# EasyEDA Pro project ProPrj_主稳压电路_2025-12-27.epro, schematic 外设电路_1

## Sheets
1 过流保护+过压保护+过热保护: Board Name: 外设电路; Create Date: 2025-11-29; Page Name: 过流保护+过压保护+电网电压预处理（含防雷保护）; Project Name: 稳压电路; Schematic Name: 外设电路; Update Date: 2025-12-01; BladeWidth: 10; Company: 嘉立创EDA; Page Size: A4; RegionStart: 1; ShowBorder: 1; TitleBlock: 1; TitleBlockPosition: 3; Version: V1.0; XRegionCount: 6; YRegionCount: 4
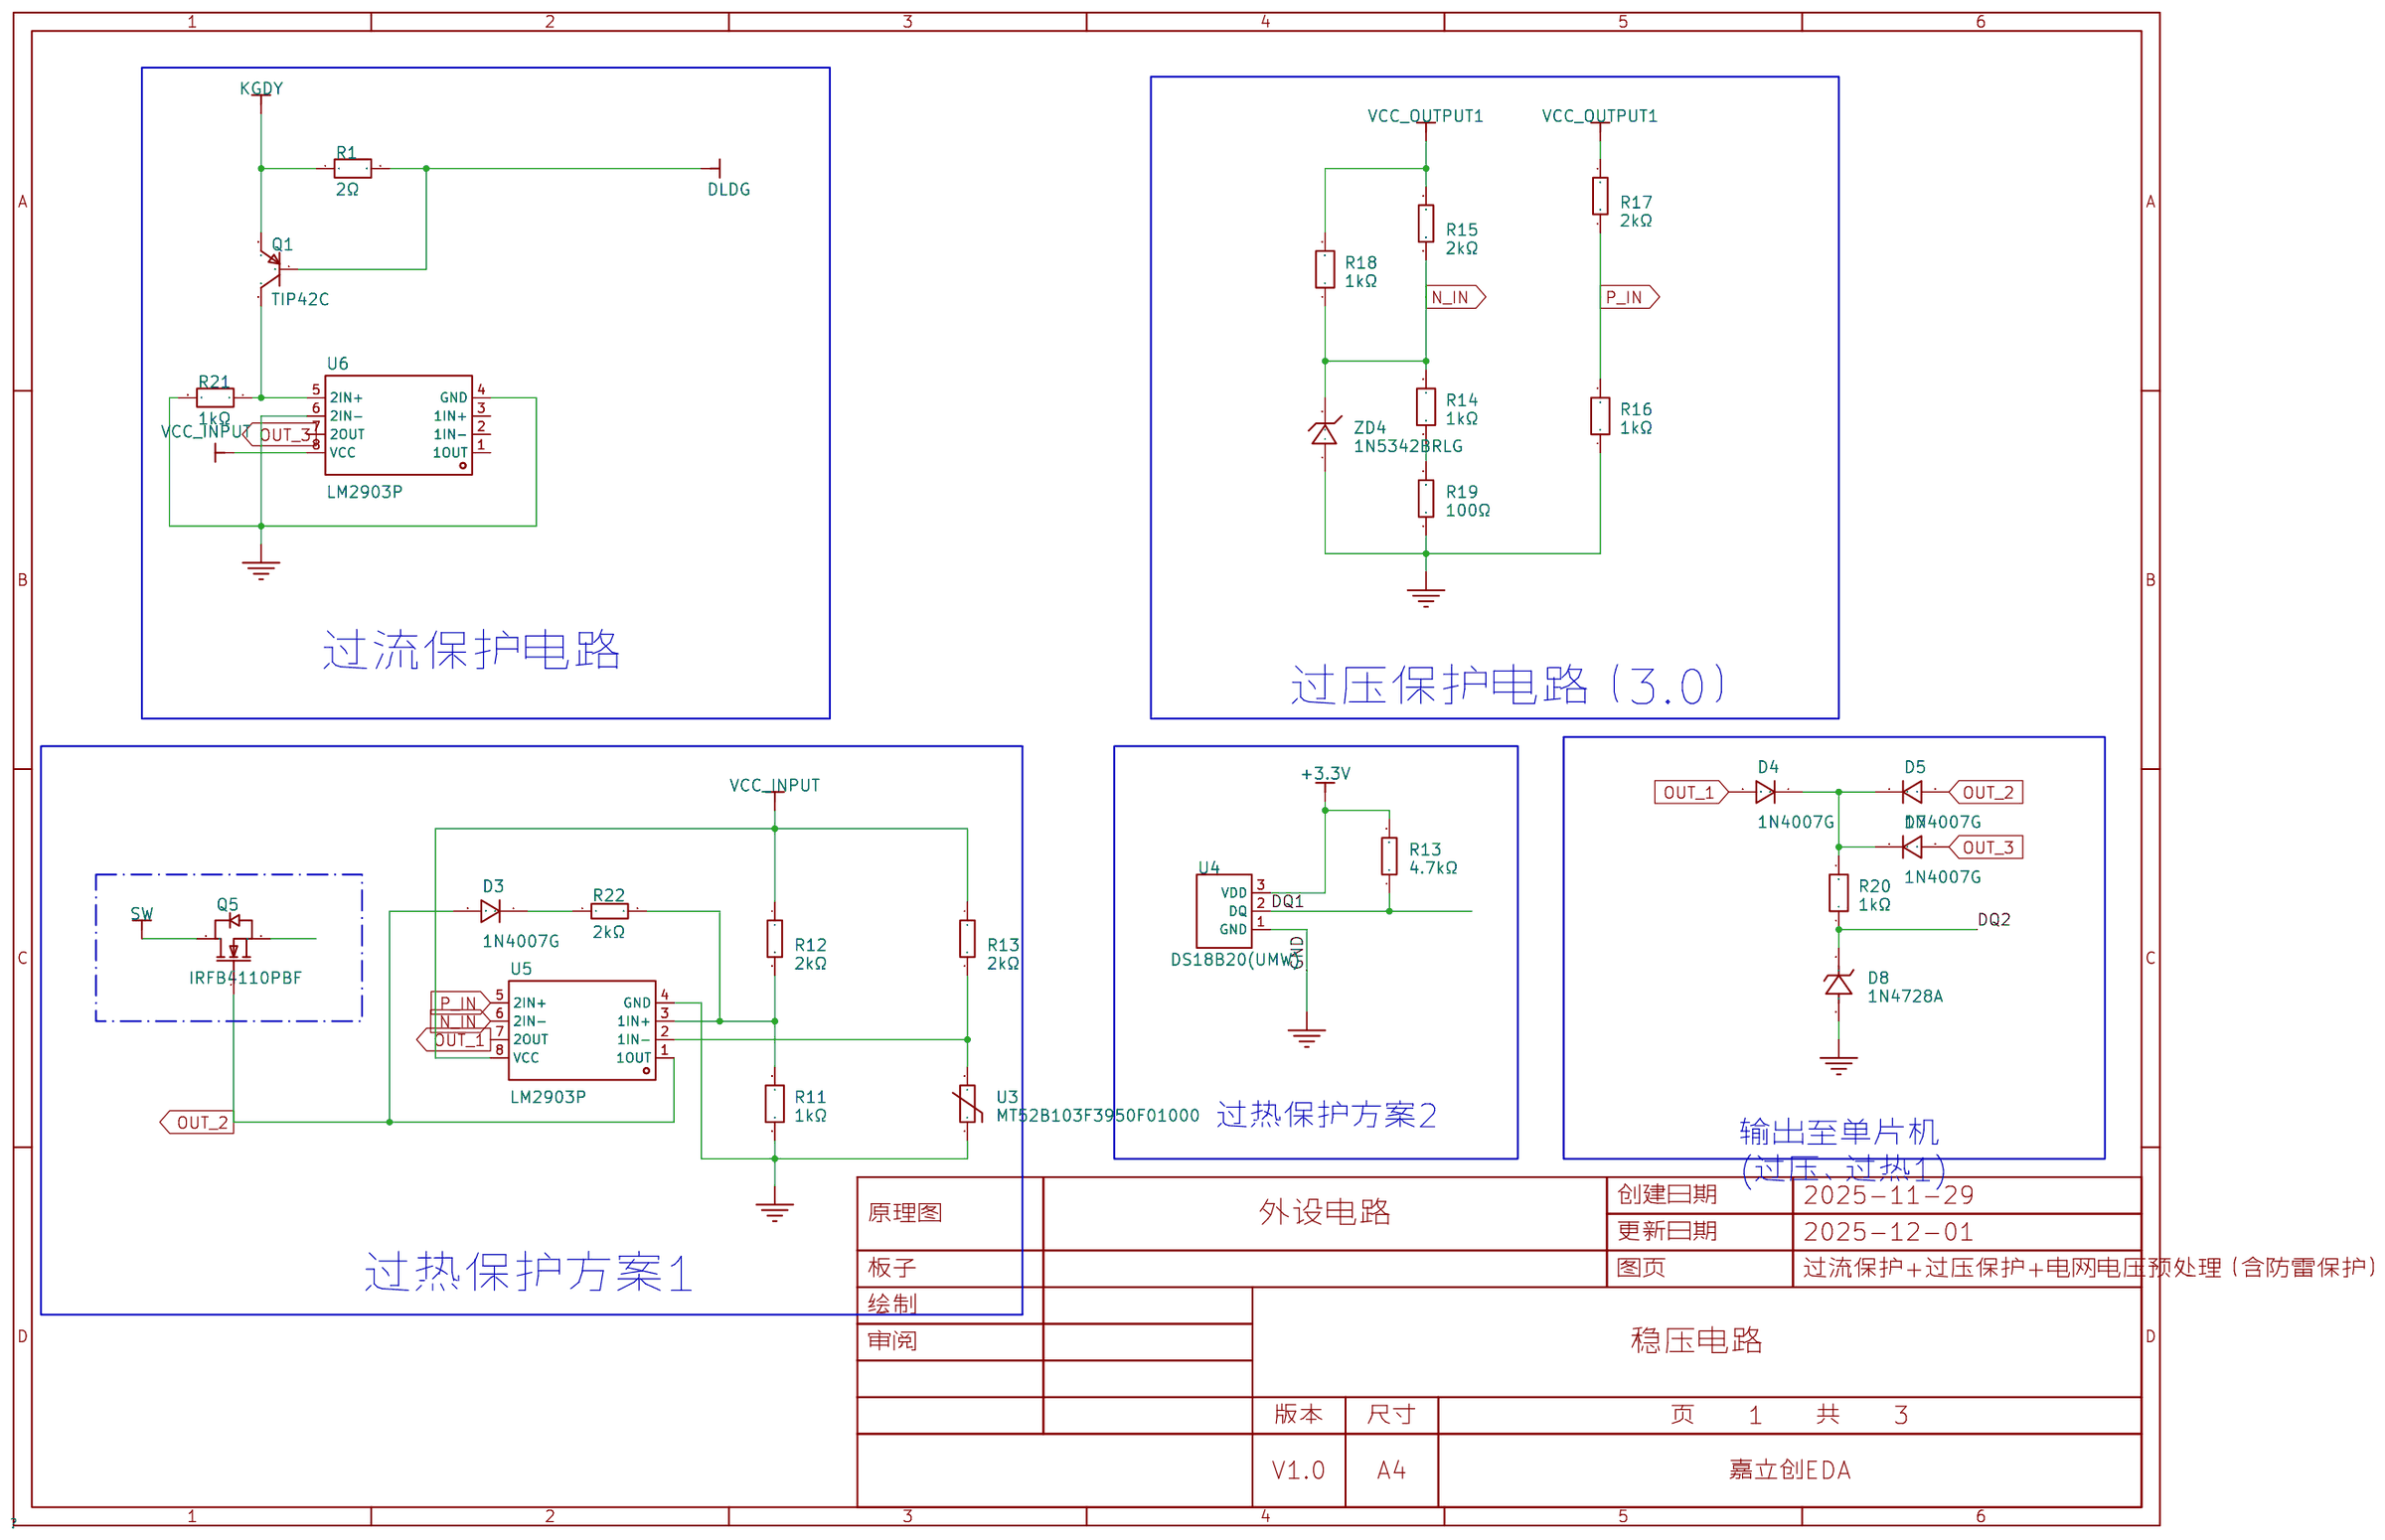
[diagram p3: 过流保护+过压保护+过热保护]
2 电压预处理: Create Date: 2025-11-30; Page Name: 过热保护
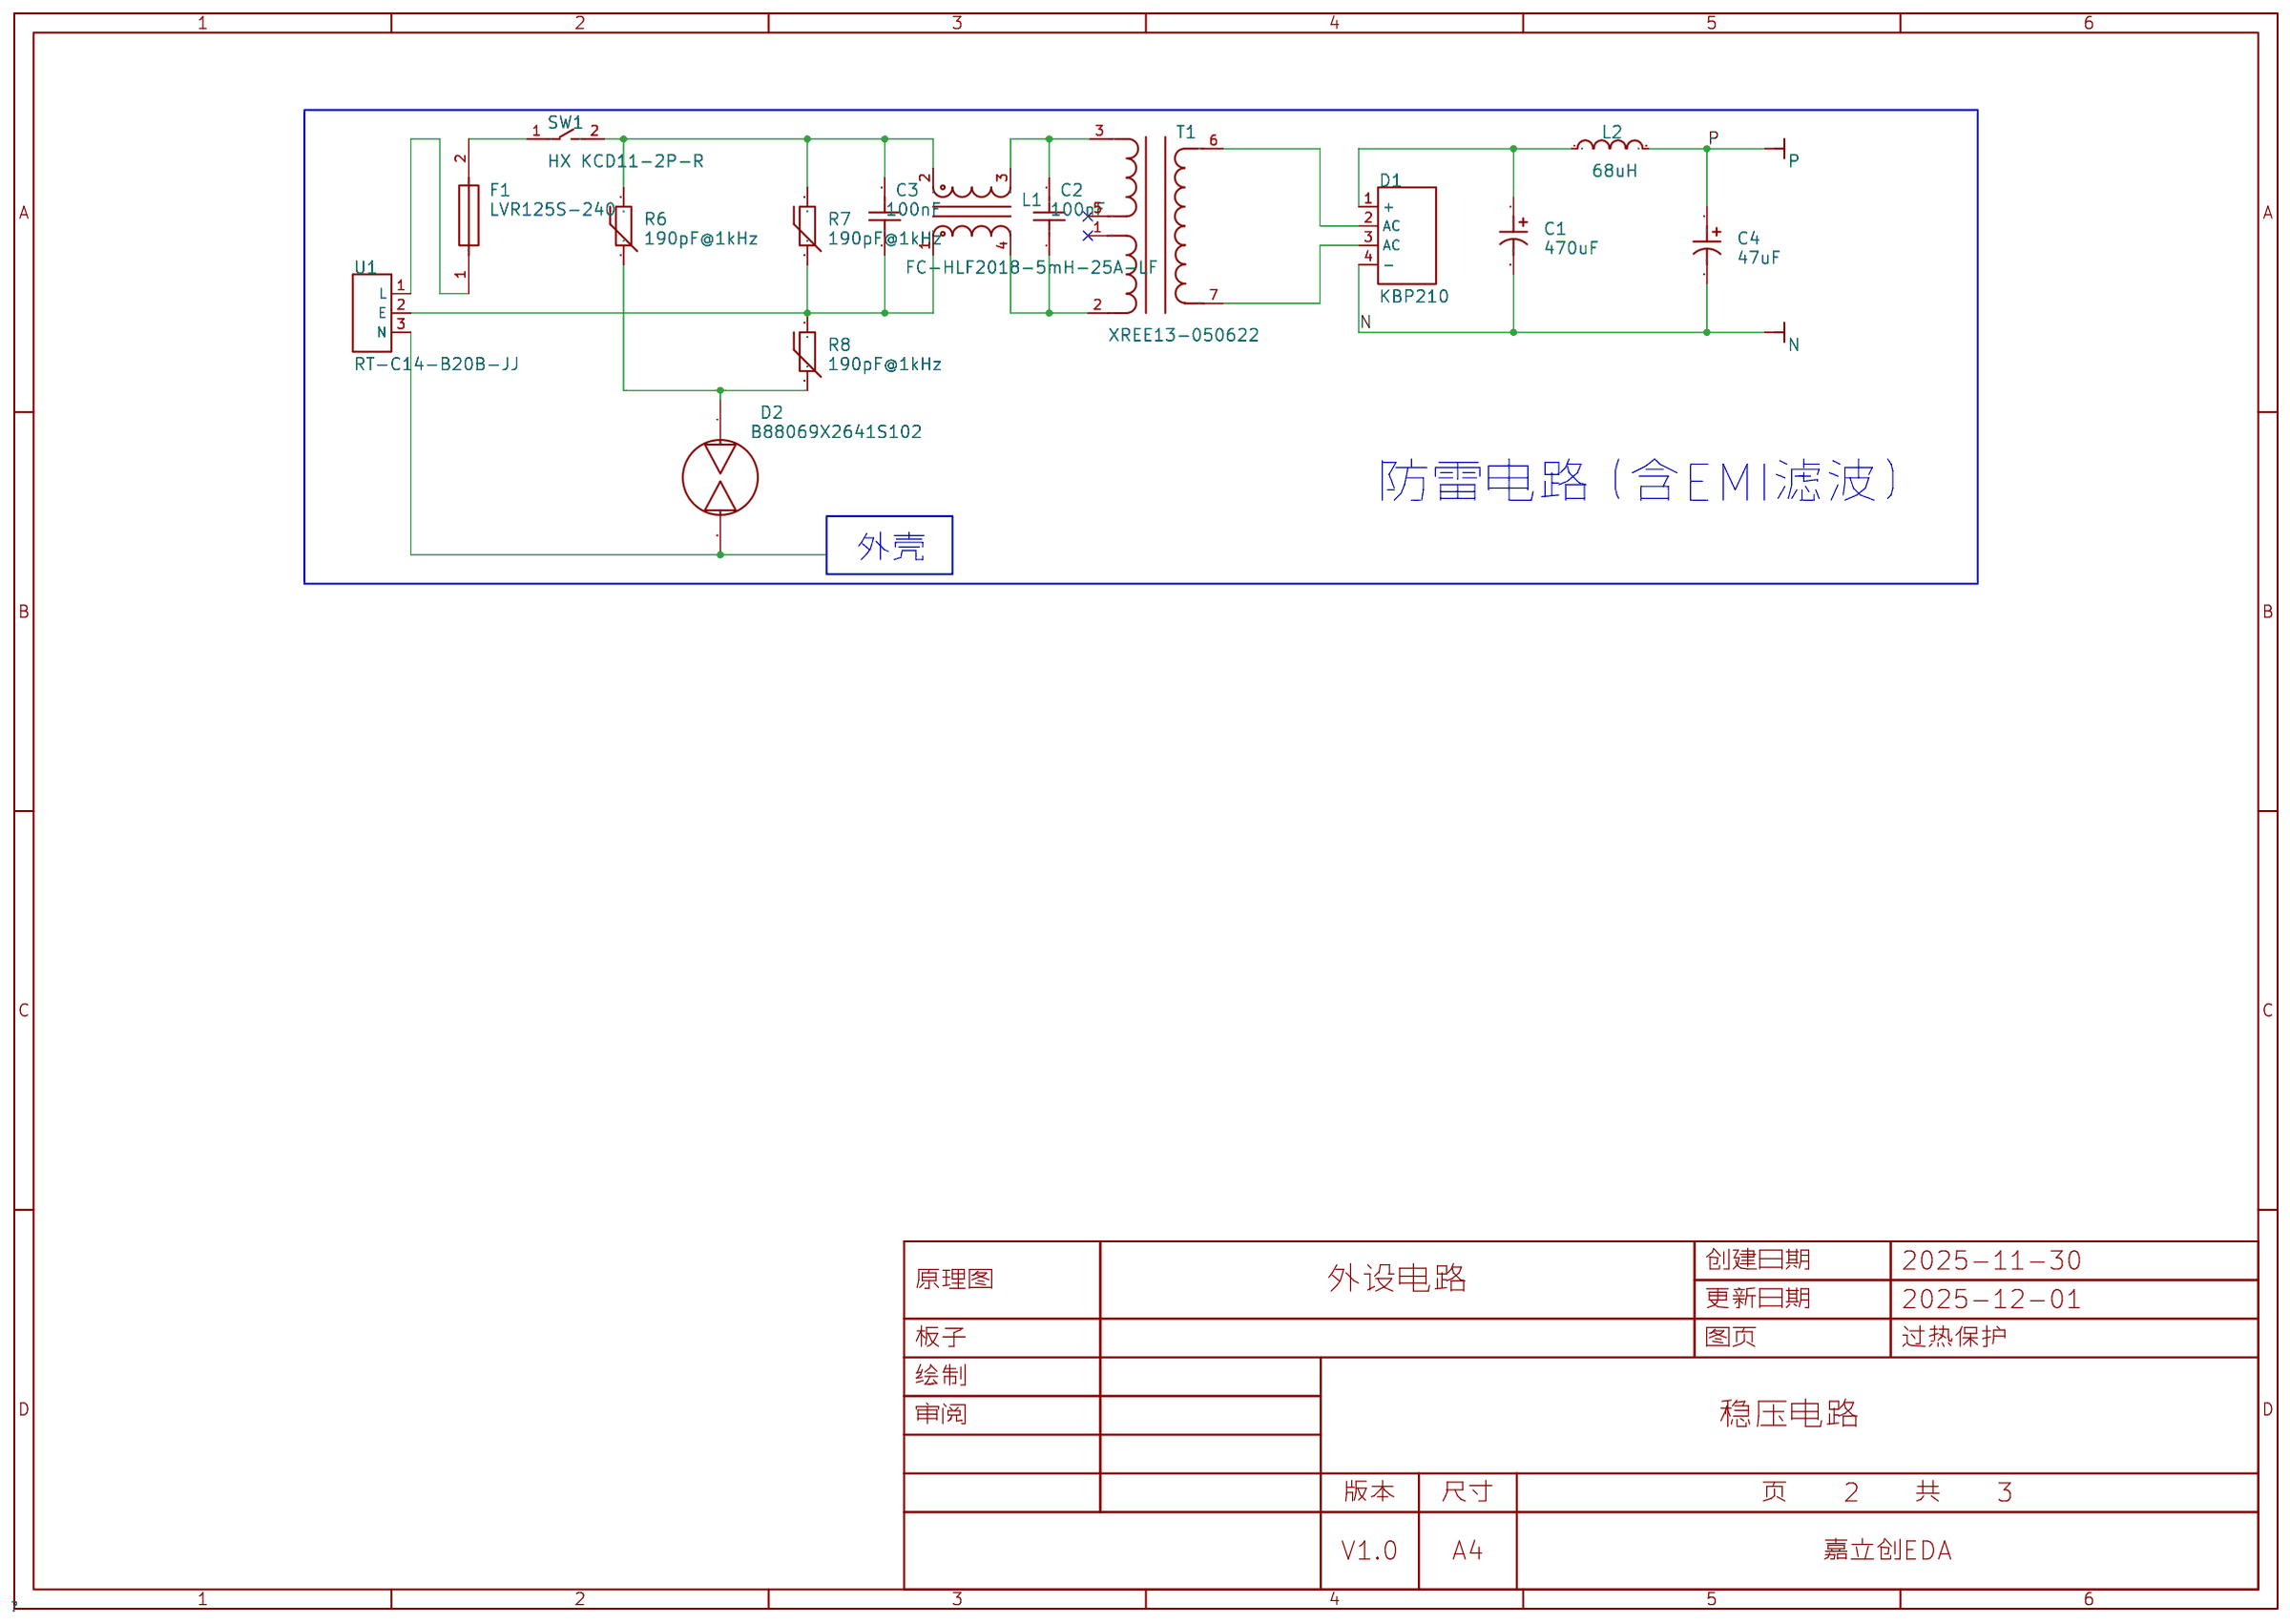
[diagram p4: 电压预处理]

## Parts
sheet 电压预处理
C1  470uF  [CAP-TH_BD10.0-P5.00-D0.6-FD]
C2  100nF  [CAP-TH_L13.0-W6.0-P10.0-D0.6]
C3  100nF  [CAP-TH_L13.0-W6.0-P10.0-D0.6]
C4  47uF  [CAP-TH_BD6.3-P2.50-D0.6-FD]
D1  KBP210  [KBP_4P-L14.5-W3.5-P3.81-L]
D2  B88069X2641S102  [DIO-DT-TH_L8.0-W6.0]
F1  LVR125S-240  [FUSE-TH_L21.2-W5.3]
L1  FC-HLF2018-5mH-25A-LF  [IND-TH_4P-L22.5-W14.5-P13.00-D1.2-LS10.80]
L2  68uH  [IND-TH_BD9.5-P5.00-D0.7]
R6  190pF@1kHz  [RES-TH_L12.5-W6.7-P7.50-D1.2]
R7  190pF@1kHz  [RES-TH_L12.5-W6.7-P7.50-D1.2]
R8  190pF@1kHz  [RES-TH_L12.5-W6.7-P7.50-D1.2]
SW1  HX KCD11-2P-R  [SW-TH_2P-L15.0-W10.5-P5.00_KCD11-2P-R]
T1  XREE13-050622  [XFMR-TH_XREE13-050622]
U1  RT-C14-B20B-JJ  [AC-IN-TH_LEGION_RT-C14-B20B-JJ]
sheet 过流保护+过压保护+过热保护
D3  1N4007G  [DO-41_BD2.4-L4.7-P8.70-D0.9-RD]
D4  1N4007G  [DO-41_BD2.4-L4.7-P8.70-D0.9-RD]
D5  1N4007G  [DO-41_BD2.4-L4.7-P8.70-D0.9-RD]
D7  1N4007G  [DO-41_BD2.4-L4.7-P8.70-D0.9-RD]
D8  1N4728A  [DO-41_BD2.4-L4.7-P8.70-D0.9-RD]
Q1  TIP42C  [ITO-220AB-3_L10.2-W4.5-P2.60-L_TIP42C]
Q5  IRFB4110PBF  [TO-220-3_L10.0-W4.5-P2.54-L]
R1  2Ω  [RES-TH_BD5.0-L15.5-P19.50-D0.8]
R11  1kΩ  [RES-TH_BD2.7-L6.2-P10.20-D0.4]
R12  2kΩ  [RES-TH_BD2.3-L6.5-P10.50-D0.5]
R13  4.7kΩ  [RES-TH_BD2.3-L6.5-P10.50-D0.5]
R13#2  2kΩ  [RES-TH_BD2.3-L6.5-P10.50-D0.5]
R14  1kΩ  [RES-TH_BD2.7-L6.2-P10.20-D0.4]
R15  2kΩ  [RES-TH_BD2.3-L6.5-P10.50-D0.5]
R16  1kΩ  [RES-TH_BD2.7-L6.2-P10.20-D0.4]
R17  2kΩ  [RES-TH_BD2.3-L6.5-P10.50-D0.5]
R18  1kΩ  [RES-TH_BD2.7-L6.2-P10.20-D0.4]
R19  100Ω  [RES-TH_BD2.3-L6.5-P10.50-D0.5]
R20  1kΩ  [RES-TH_BD2.7-L6.2-P10.20-D0.4]
R21  1kΩ  [RES-TH_BD2.7-L6.2-P10.20-D0.4]
R22  2kΩ  [RES-TH_BD2.3-L6.5-P10.50-D0.5]
U3  MT52B103F3950F01000  [RES-TH_BD2.0-P1.80-D0.3]
U4  DS18B20(UMW)  [TO-92-3_L4.9-W3.7-P1.27-L]
U5  LM2903P  [DIP-8_L9.8-W6.6-P2.54-LS7.6-BL]
U6  LM2903P  [DIP-8_L9.8-W6.6-P2.54-LS7.6-BL]
ZD4  1N5342BRLG  [DO-41_BD2.8-L4.2-P8.00-D0.7-FD]

## Library data of the parts
C1 = ERA50V470M10X20: 容值:470uF;精度:±20%;额定电压:50V;; LCSC Part Name: 470uF ±20% 50V; Supplier Part: C49256816; Manufacturer: JIERR(捷而瑞); Supplier Footprint: 插件,D10xL20mm; JLCPCB Part Class: 扩展库; Datasheet: https://item.szlcsc.com/datasheet/ERA50V470M10X20/51692216.html; Supplier: LCSC; Tolerance: ±20%; Voltage Rating: 50V; Pin Spacing: 5mm; Diameter: 10mm; Height - Seated (Max): 20mm; Lifetime: 2000hrs@105℃; Operating Temperature: -40℃~+105℃
C2 C3 = XY4005: 容值:100nF;精度:±10%;工作电压(AC):440V;防护等级:X1,Y1;; LCSC Part Name: 等级:X1,Y1 100nF ±10% 440V; Supplier Part: C917419; Manufacturer: CRC(创容); Supplier Footprint: 插件; JLCPCB Part Class: 扩展库; Datasheet: https://atta.szlcsc.com/upload/public/pdf/source/20201117/C917419_A560E178D41C41E6D9723584B80CE00C.pdf; Supplier: LCSC; Tolerance: ±10%; Voltage(AC): 440V; Ratings: X1,Y1; Operating Temperature: -40℃~+110℃
C4 = ERA63V47M6X12: 容值:47uF;精度:±20%;额定电压:63V;; LCSC Part Name: 47uF ±20% 63V; Supplier Part: C49256820; Manufacturer: JIERR(捷而瑞); Supplier Footprint: 插件,D6.3xL12mm; JLCPCB Part Class: 扩展库; Datasheet: https://item.szlcsc.com/datasheet/ERA63V47M6X12/51692220.html; Supplier: LCSC; Tolerance: ±20%; Voltage Rating: 63V; Pin Spacing: 2.5mm; Diameter: 6.3mm; Height - Seated (Max): 12mm; Lifetime: 2000hrs@105℃; Operating Temperature: -40℃~+105℃
D1 = KBP210_C350524: 正向压降(Vf):1.1V@2A;直流反向耐压(Vr):1kV;整流电流:2A;非重复峰值浪涌电流 (Ifsm):30A;; LCSC Part Name: 耐压:1000V 电流:2A; Supplier Part: C350524; Manufacturer: baocheng(宝乘); Supplier Footprint: KBP; JLCPCB Part Class: 扩展库; Datasheet: https://item.szlcsc.com/datasheet/KBP210/326663.html; Supplier: LCSC; Voltage - Forward(Vf@If): 1.1V@2A; Voltage - DC Reverse(Vr): 1kV; Current - Rectified: 2A; Reverse Leakage Current (Ir): 10uA; Non-Repetitive Peak Forward Surge Current: 30A; Operating Junction Temperature Range: -55℃~+150℃
D2 = B88069X2641S102: 极数:2;直流击穿电压(Vdc):800V;精度:-15%~+20%;脉冲放电电流:5kA;; LCSC Part Name: 800V 5kA 2端 GDT; Supplier Part: C125602; Manufacturer: TDK; Supplier Footprint: 插件; JLCPCB Part Class: 扩展库; Datasheet: https://item.szlcsc.com/datasheet/B88069X2641S102/136879.html; Supplier: LCSC; Number of Poles: 2; Voltage - DC Spark Over (Nom): 800V; Tolerance: -15%~+20%; Impulse Discharge Current: 5kA; inter-electrode capacitance: 1.5pF; Impulse Breakdown Voltage(Vimp): 1.2kV; Operating Temperature Range: -40℃~+125℃; Length: 6mm; Width: 8mm; Height: 8.2mm
F1 = LVR125S-240: 耐压(Vmax):265V;最大电流(Imax):12.5A;保持电流(Ihold):1.25A;跳闸电流(Itrip):2.5A;; LCSC Part Name: 240V 1.25A 插件自恢复; Supplier Part: C1562056; Manufacturer: Littelfuse(美国力特); Supplier Footprint: 插件; JLCPCB Part Class: Extended Part; Datasheet: https://item.szlcsc.com/datasheet/LVR125S-240/1652865.html; Supplier: LCSC; Voltage - Max: 265V; Current - Max: 12.5A; Hold Current: 1.25A; Trip Current: 2.5A; Power Dissipation: 3.28W; Resistance - Initial (Ri) (Min): 165mΩ; Resistance - Post Trip (R1) (Max): 440mΩ; Time to Trip(Max): 23s
L1 = FC-HLF2018-5mH-25A-LF: 通道数:-;电感@频率:5mH;阻抗@频率:-;直流电阻(DCR):6.5mΩ;; LCSC Part Name: 插件共模滤波器; Supplier Part: C5307518; Manufacturer: FC(方成); Supplier Footprint: 插件; JLCPCB Part Class: 扩展库; Datasheet: https://atta.szlcsc.com/upload/public/pdf/source/20240710/C40273581A0B3C9CC6303397C1971AFE.pdf; Supplier: LCSC; Current Rating: 25A; Inductance @ Frequency: 5mH; DC Resistance(DCR): 6.5mΩ; Operating Temperature: -40℃~+125℃
L2 = VLU0810-680K: 电感值:68uH;精度:±10%;; Supplier Part: C72615; Manufacturer: FH(风华); Supplier Footprint: 插件; JLCPCB Part Class: 扩展库; Datasheet: https://item.szlcsc.com/datasheet/VLU0810-680K/73727.html; Supplier: LCSC; Tolerance: ±10%
R6-R8 = 10D471K_C8760: 压敏电压:423V~517V;钳位电压:775V;工作电压(DC):385V;工作电压(AC):300V;; LCSC Part Name: 钳位电压775V 42.3焦耳 插件压敏电阻; Supplier Part: C8760; Manufacturer: RUILON(瑞隆源); Manufacturer Part: 10D471K; Supplier Footprint: 插件,P=7.5mm; JLCPCB Part Class: 扩展库; Datasheet: https://item.szlcsc.com/datasheet/10D471K/9271.html; Supplier: LCSC; Varistor Voltage: 423V~517V; Clamping Voltage: 775V; Maximum DC Volts: 385V; Maximum AC Volts: 300V; Peak Current: 2.5kA; Energy: 42.3J; Rated Wattage: 400mW
SW1 = HX KCD11-2P-R: 带灯:无;引脚样式:焊片;额定电流:3A;额定电压(AC):250V;电路结构:单刀单掷;工作寿命:1万次;; LCSC Part Name: 10.5*15mm 两脚两档跷板开关 红钮; Supplier Part: C6917318; Manufacturer: hanxia(韩下); Supplier Footprint: 插件; JLCPCB Part Class: 扩展库; Datasheet: https://item.szlcsc.com/datasheet/HX%2520KCD11-2P-R/7881930.html; Supplier: LCSC; With Lamp: 无; Termination Style: 焊片; Actuator Color: 红色; Current Rating: 3A; Voltage Rating (AC): 250V; Circuit: 单刀单掷; Life: 1万次
T1 = XREE13-050622: XREE13 卧式  单边加长5+2  5.0mH; LCSC Part Name: XREE13 卧式  单边加长5+2  5.0mH; Supplier Part: C49118509; Manufacturer: XR(祥如); Supplier Footprint: 插件; JLCPCB Part Class: 扩展库; Datasheet: https://item.szlcsc.com/datasheet/XREE13-050622/51502685.html; Supplier: LCSC
U1 = RT-C14-B20B-JJ: 品字AC插座 Electrical rating：安规认证 10A 250VAC VDE 15A 250VAC UL CUL; Supplier Part: C19190834; Manufacturer: Legion(六钧); Supplier Footprint: 插件; JLCPCB Part Class: 扩展库; Datasheet: https://atta.szlcsc.com/upload/public/pdf/source/20231110/74D7F96B63247F0701E9233320C7B445.pdf; Supplier: LCSC; Standard: IEC 320-C14; Number of Ports: 1; PIN Number Per Port: 3; Mounting Style: 弯插; Current Rating (Max): 15A; Rated Voltage (Max): 250V
D3-D5 D7 = 1N4007G_C232439: 二极管配置:-;正向压降(Vf):930mV@1A;直流反向耐压(Vr):1kV;整流电流:1A;; Supplier Part: C232439; Manufacturer: onsemi(安森美); Supplier Footprint: DO-41; JLCPCB Part Class: 扩展库; Datasheet: https://item.szlcsc.com/datasheet/1N4007G/232362.html; Supplier: LCSC; Voltage - Forward(Vf@If): 930mV@1A; Voltage - DC Reverse(Vr): 1kV; Current - Rectified: 1A; Reverse Leakage Current (Ir): 50nA@1kV; Non-Repetitive Peak Forward Surge Current: 30A; Operating Junction Temperature Range: -65℃~+175℃
D8 = 1N4728A_C7441074: LCSC Part Name: 耐压:3.3V 电流:100uA@1V; Supplier Part: C7441074; Manufacturer: XCH(旭昌辉); Supplier Footprint: DO-41; JLCPCB Part Class: Extended Part; Datasheet: https://item.szlcsc.com/datasheet/1N4728A/8465179.html; Supplier: LCSC; Zener Voltage(Nom): 3.3V; Reverse Leakage Current (Ir): 100uA@1V; Zener Voltage(Range): 3.14V~3.47V; Pd - Power Dissipation: 1W; Impedance(Zzt): 10Ω; Impedance(Zzk): 400Ω; Operating Junction Temperature Range: -55℃~+150℃
Q1 = TIP42C_C410524: LCSC Part Name: PNP 电流:9A 电压:100V; Supplier Part: C410524; Manufacturer: ST(意法半导体); Supplier Footprint: ITO-220AB-3; JLCPCB Part Class: 扩展库; Datasheet: https://item.szlcsc.com/datasheet/TIP42C/401054.html; Supplier: LCSC; type: PNP; Current - Collector(Ic): 9A; Collector - Emitter Voltage VCEO: 100V; Pd - Power Dissipation: 65W; DC Current Gain: 15@6A,4V; Current - Collector Cutoff: 700uA; Vce Saturation(VCE(sat)): 1.5V@6A,0.6A; Operating Temperature: -65℃~+150℃; Emitter-Base Voltage(Vebo): 5V; Number: 1个PNP
Q5 = IRFB4110PBF: 数量:1个N沟道;漏源电压(Vdss):100V;连续漏极电流(Id):180A;导通电阻(RDS(on)):4.5mΩ@10V;耗散功率(Pd):370W;阈值电压(Vgs(th)):4V@250uA;; LCSC Part Name: 1个N沟道 耐压:100V 电流:180A; Supplier Part: C2650; Manufacturer: Infineon(英飞凌); Supplier Footprint: TO-220; JLCPCB Part Class: 扩展库; Datasheet: https://item.szlcsc.com/datasheet/IRFB4110PBF/3031.html; Supplier: LCSC; Number: 1个N沟道; Drain to Source Voltage: 100V; Current - Continuous Drain(Id): 180A; RDS(on): 4.5mΩ@10V; Pd - Power Dissipation: 370W; Gate Threshold Voltage (Vgs(th)): 4V@250uA; Gate Charge(Qg): 210nC@10V; Input Capacitance(Ciss): 9.62nF; Reverse Transfer Capacitance (Crss@Vds): 250pF; Operating Temperature: -55℃~+175℃; Type: N沟道; Output Capacitance(Coss): 670pF
R1 = RN3WS2RFT/BA1: LCSC Part Name: 2Ω ±1% 3W 金属膜电阻; Supplier Part: C433560; Manufacturer: Tyohm(幸亚电阻); Supplier Footprint: 插件,D5xL15mm; JLCPCB Part Class: 扩展库; Datasheet: https://item.szlcsc.com/datasheet/RN3WS2RFT%252FBA1/430565.html; Supplier: LCSC; Type: 金属膜电阻; Tolerance: ±1%; Voltage-Supply(Max): 500V; Power(Watts): 3W; Temperature Coefficient: ±100ppm/℃; Operating Temperature: -55℃~+125℃
R11 R14 R16 R18 R20 R21 = MF1/4W-1K±1%-ST52: 电阻类型:金属膜电阻;阻值:1kΩ;精度:±1%;功率:250mW;温度系数:±100ppm/℃;; LCSC Part Name: 金属膜电阻 1kΩ ±1% 250mW; Supplier Part: C2903245; Manufacturer: VO(翔胜); Supplier Footprint: 插件,D2.7xL6.2mm; JLCPCB Part Class: 扩展库; Datasheet: https://item.szlcsc.com/datasheet/MF1%252F4W-1K%25C2%25B11%2525-ST52/3158996.html; Supplier: LCSC; Type: 金属膜电阻; Tolerance: ±1%; Voltage-Supply(Max): 250V; Power(Watts): 250mW; Temperature Coefficient: ±100ppm/℃; Operating Temperature: -55℃~+155℃
R12 R13#2 R15 R17 R22 = MF1/4W-2KΩ±1% T: 电阻类型:金属膜电阻;阻值:2kΩ;精度:±1%;功率:250mW;温度系数:±100ppm/℃;; LCSC Part Name: 2kΩ ±1% 250mW 金属膜电阻 圆柱状直插; Supplier Part: C119330; Manufacturer: CCO(千志电子); Supplier Footprint: 插件,D2.3xL6.5mm; JLCPCB Part Class: 扩展库; Datasheet: https://item.szlcsc.com/datasheet/MF1%252F4W-2K%25CE%25A9%25C2%25B11%2525%2520T/120599.html; Supplier: LCSC; Type: 金属膜电阻; Tolerance: ±1%; Voltage-Supply(Max): 250V; Power(Watts): 250mW; Temperature Coefficient: ±100ppm/℃; Operating Temperature: -55℃~+155℃
R13 = MF1/4W-4.7KΩ±1% T: 电阻类型:金属膜电阻;阻值:4.7kΩ;精度:±1%;功率:250mW;温度系数:±100ppm/℃;; LCSC Part Name: 4.7kΩ ±1% 250mW 金属膜电阻 圆柱状直插; Supplier Part: C119339; Manufacturer: CCO(千志电子); Supplier Footprint: 插件,D2.3xL6.5mm; JLCPCB Part Class: 扩展库; Datasheet: https://item.szlcsc.com/datasheet/MF1%252F4W-4.7K%25CE%25A9%25C2%25B11%2525%2520T/120608.html; Supplier: LCSC; Type: 金属膜电阻; Tolerance: ±1%; Voltage-Supply(Max): 250V; Power(Watts): 250mW; Temperature Coefficient: ±100ppm/℃; Operating Temperature: -55℃~+155℃
R19 = MF1/4W-100Ω±1% T: LCSC Part Name: 100Ω ±1% 250mW 金属膜电阻; Supplier Part: C119304; Manufacturer: CCO(千志电子); Supplier Footprint: 插件,D2.3xL6.5mm; JLCPCB Part Class: Extended Part; Datasheet: https://atta.szlcsc.com/upload/public/pdf/source/20190910/C427326_62A6D058BC0FF74963A2F22379CA06CE.pdf; Supplier: LCSC; Type: 金属膜电阻; Tolerance: ±1%; Voltage-Supply(Max): 250V; Power(Watts): 250mW; Temperature Coefficient: ±100ppm/℃; Operating Temperature: -55℃~+155℃
U3 = MT52B103F3950F01000: B值精度:±1%;; Supplier Part: C3000141; Manufacturer: STE(松田); Supplier Footprint: 插件; JLCPCB Part Class: 扩展库; Datasheet: https://atta.szlcsc.com/upload/public/pdf/source/20220421/4C9ED61AEEBD0560001C4E62DFAA304B.pdf; Supplier: LCSC; B Constant Tolerance: ±1%
U4 = DS18B20(UMW): 温度范围:-55℃~+125℃;精度:±0.4℃;接口类型:-;; LCSC Part Name: DS18B20; Supplier Part: C376006; Manufacturer: UMW(友台半导体); Supplier Footprint: TO-92; JLCPCB Part Class: 扩展库; Datasheet: https://item.szlcsc.com/datasheet/DS18B20(UMW)/348632.html; Supplier: LCSC; Temperature Range: -55℃~+125℃; Tolerance: ±0.4℃; Voltage - Supply: 3V~5.5V
U5 U6 = LM2903P: 比较器数:双路;输入失调电压(Vos):2mV;输入偏置电流(Ib):25nA;; LCSC Part Name: 双差分比较器; Supplier Part: C14770; Manufacturer: TI(德州仪器); Supplier Footprint: PDIP-8; JLCPCB Part Class: 扩展库; Datasheet: https://www.ti.com/cn/lit/gpn/lm2903; Supplier: LCSC; Number of Channels: 双路; Vos - Input Offset Voltage: 2mV; Ib - Input Bias Current: 25nA; Propagation Delay Time: 1.3us; Output Type: TTL；CMOS; Quiescent Current: 800uA; Operating Temperature: -40℃~+125℃
ZD4 = 1N5342BRLG: 二极管配置:独立式;稳压值(标称值):6.8V;稳压值(范围):6.46V~7.14V;耗散功率(Pd):5W;; LCSC Part Name: 独立式 耐压:6.8V 电流:10uA@5.2V; Supplier Part: C44808; Manufacturer: onsemi(安森美); Supplier Footprint: DO-41; JLCPCB Part Class: 扩展库; Datasheet: https://item.szlcsc.com/datasheet/1N5342BRLG/45810.html; Supplier: LCSC; Diode Configuration: 独立式; Zener Voltage(Nom): 6.8V; Reverse Leakage Current (Ir): 10uA@5.2V; Zener Voltage(Range): 6.46V~7.14V; Pd - Power Dissipation: 5W; Impedance(Zzt): 1Ω; Impedance(Zzk): 200Ω; Operating Junction Temperature Range: -65℃~+200℃

## Nets
+3.3V: R13.2 U4.3(VDD)
GND: D8.2(A) R11.1 R16.1 R19.1 R21.2 U3.1 U4.1(GND) U5.4(GND) U6.4(GND) U6.6(2IN-) ZD4.1(A)
VCC_INPUT: R12.1 R13#2.1 U5.8(VCC) U6.8(VCC)
VCC_OUTPUT1: R15.1 R17.1 R18.2
DLDG: Q1.1(B) R1.2
DQ1: R13.1 U4.2(DQ)
DQ2: D8.1(K) R20.1
KGDY: Q1.3(E) R1.1
N: C1.2 C4.2 D1.4(-)
N_IN: R14.2 R15.2 R18.1 U5.6(2IN-) ZD4.2(K)
OUT_1: D4.2 U5.7(2OUT)
OUT_2: D3.2 D5.2 Q5.1(G) U5.1(1OUT)
OUT_3: D7.2 U6.7(2OUT)
P: C4.1 L2.2
P_IN: R16.2 R17.2 U5.5(2IN+)
SW: Q5.2(D)
Net-(C1-1): C1.1 D1.1(+) L2.1
Net-(C2-1): C2.1 L1.4 T1.2
Net-(C2-2): C2.2 L1.3 T1.3
Net-(C3-1): C3.1 L1.1 R7.2 R8.1 U1.2(E)
Net-(C3-2): C3.2 L1.2 R6.1 R7.1 SW1.2
Net-(D1-2): D1.2(AC) T1.6
Net-(D1-3): D1.3(AC) T1.7
Net-(D2-1): D2.1 R6.2 R8.2
Net-(D2-2): D2.2 U1.3(N)
Net-(D3-1): D3.1 R22.1
Net-(D4-1): D4.1 D5.1 D7.1 R20.2
Net-(F1-1): F1.1 U1.1(L)
Net-(F1-2): F1.2 SW1.1
Net-(Q1-2): Q1.2(C) R21.1 U6.5(2IN+)
Net-(R11-2): R11.2 R12.2 R22.2 U5.3(1IN+)
Net-(R13#2-2): R13#2.2 U3.2 U5.2(1IN-)
Net-(R14-1): R14.1 R19.2

Not connected (* = marked no-connect by the designer): Q5 3(S); T1 1* 5*; U6 1(1OUT) 2(1IN-) 3(1IN+)

## Notes on the sheets
sheet 1
- 过流保护电路
- 过压保护电路（3.0）
- 输出至单片机
  (过压、过热1)
- 过热保护方案2
- 过热保护方案1
sheet 2
- 防雷电路（含EMI滤波）
- 外壳
